# EAGLE design PhotonSMTTest1 (EAGLE 7.3.0)
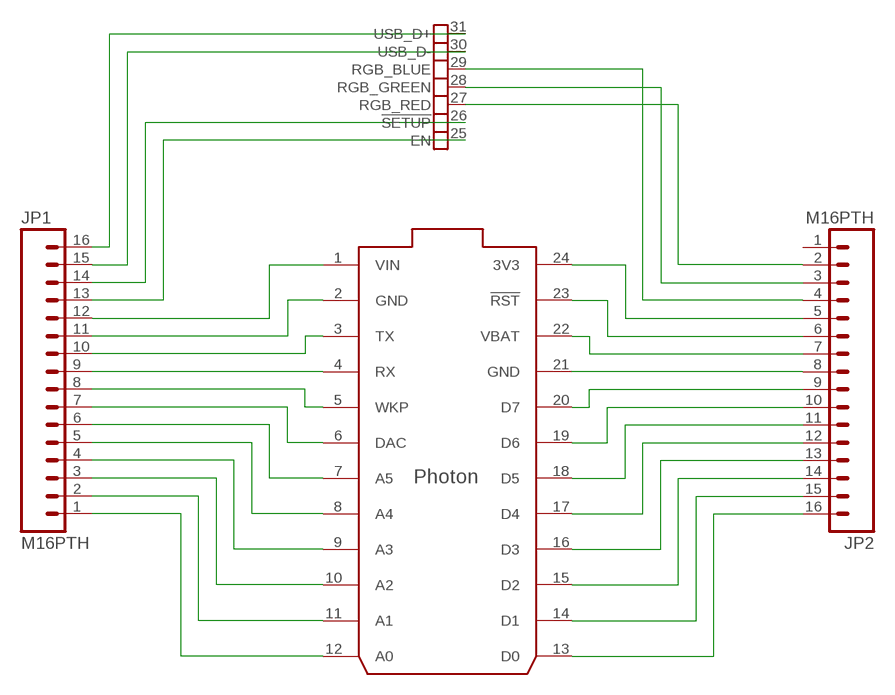
[diagram p0: schematic, sheet 1]

## Parts
.  PHOTON_SMD  [PHOTON_SMD]
JP1  M16PTH  [1X16]
JP2  M16PTH  [1X16]

## Nets
GND: ..2(GND) ..21(GND) JP1.11 JP2.8
N$1: ..1(VIN) JP1.12
N$2: ..31(USB_D+) JP1.16
N$3: ..3(TX) JP1.10
N$4: ..4(RX) JP1.9
N$5: ..6(DAC) JP1.7
N$6: ..8(A4) JP1.5
N$7: ..7(A5) JP1.6
N$8: ..5(WKP) JP1.8
N$9: ..9(A3) JP1.4
N$10: ..10(A2) JP1.3
N$11: ..11(A1) JP1.2
N$12: ..12(A0) JP1.1
N$13: ..24(3V3) JP2.5
N$14: ..23(!RST) JP2.6
N$15: ..22(VBAT) JP2.7
N$16: ..30(USB_D-) JP1.15
N$17: ..20(D7) JP2.9
N$18: ..19(D6) JP2.10
N$19: ..18(D5) JP2.11
N$20: ..17(D4) JP2.12
N$21: ..16(D3) JP2.13
N$22: ..15(D2) JP2.14
N$23: ..14(D1) JP2.15
N$24: ..13(D0) JP2.16
N$25: ..29(RGB_BLUE) JP2.4
N$26: ..28(RGB_GREEN) JP2.3
N$27: ..27(RGB_RED) JP2.2
N$30: ..26(!SETUP) JP1.14
N$31: ..25(EN) JP1.13
Unconnected: JP2.1

## Library data of the parts
. = Particle-Devices:PHOTON_SMD: Particle Photon (without headers) WiFi development board footprint - designed to be surface mounted with 7 extra exposed pads on the bottom of the board which include, 3 RGB LED outputs, /SETUP, EN (3.3V SMPS enable input), USB D+ and USB D-.
JP1 JP2 = rickk2:M16: 1x16 .1" header

## Board
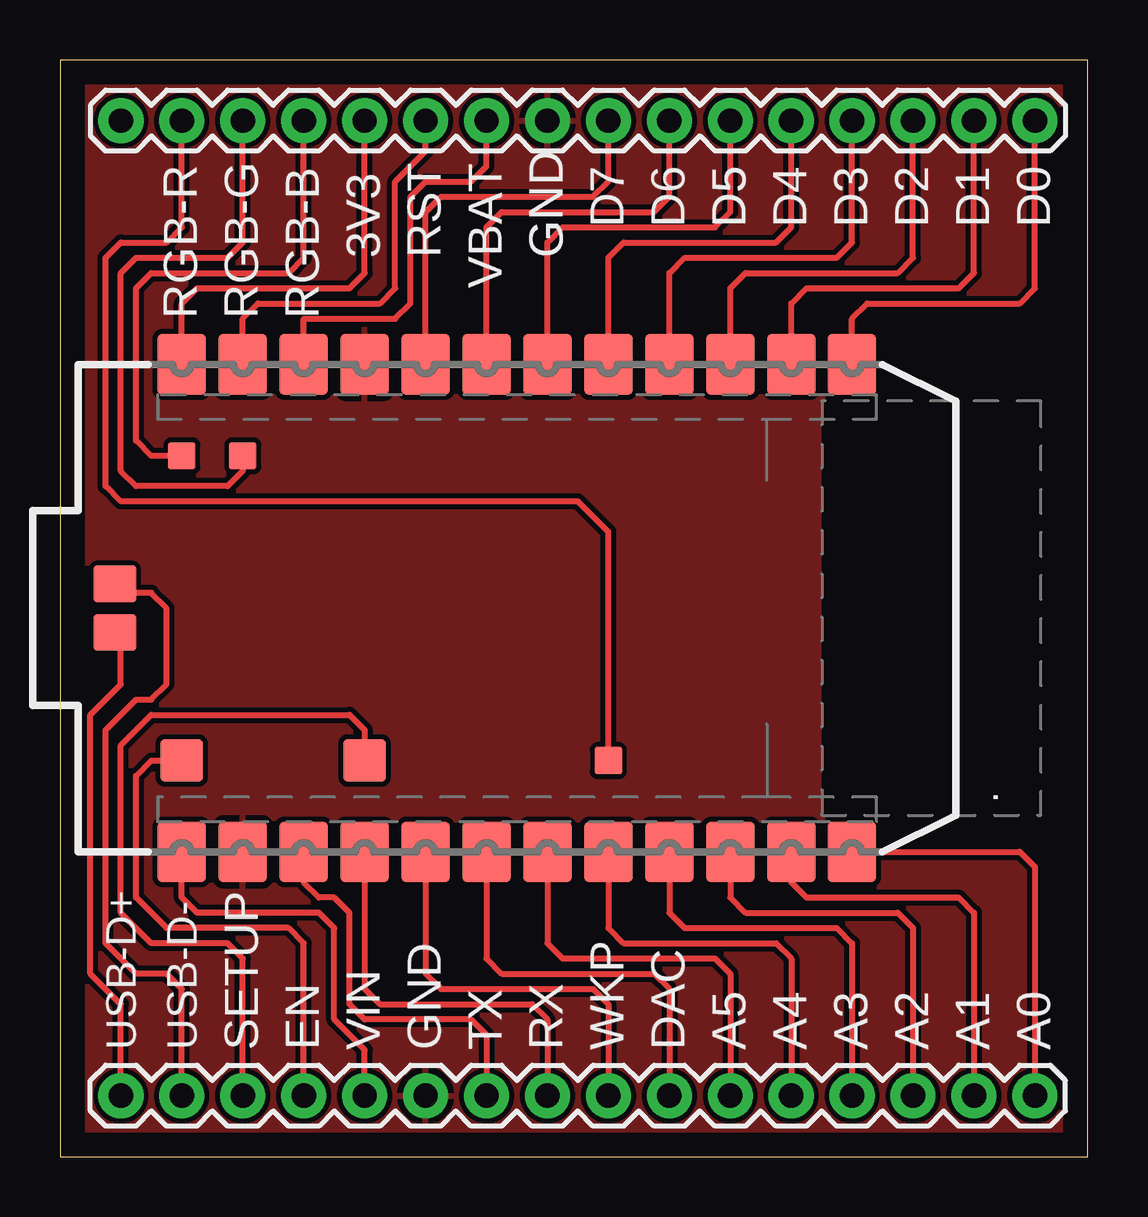
[diagram p1: board, top side]
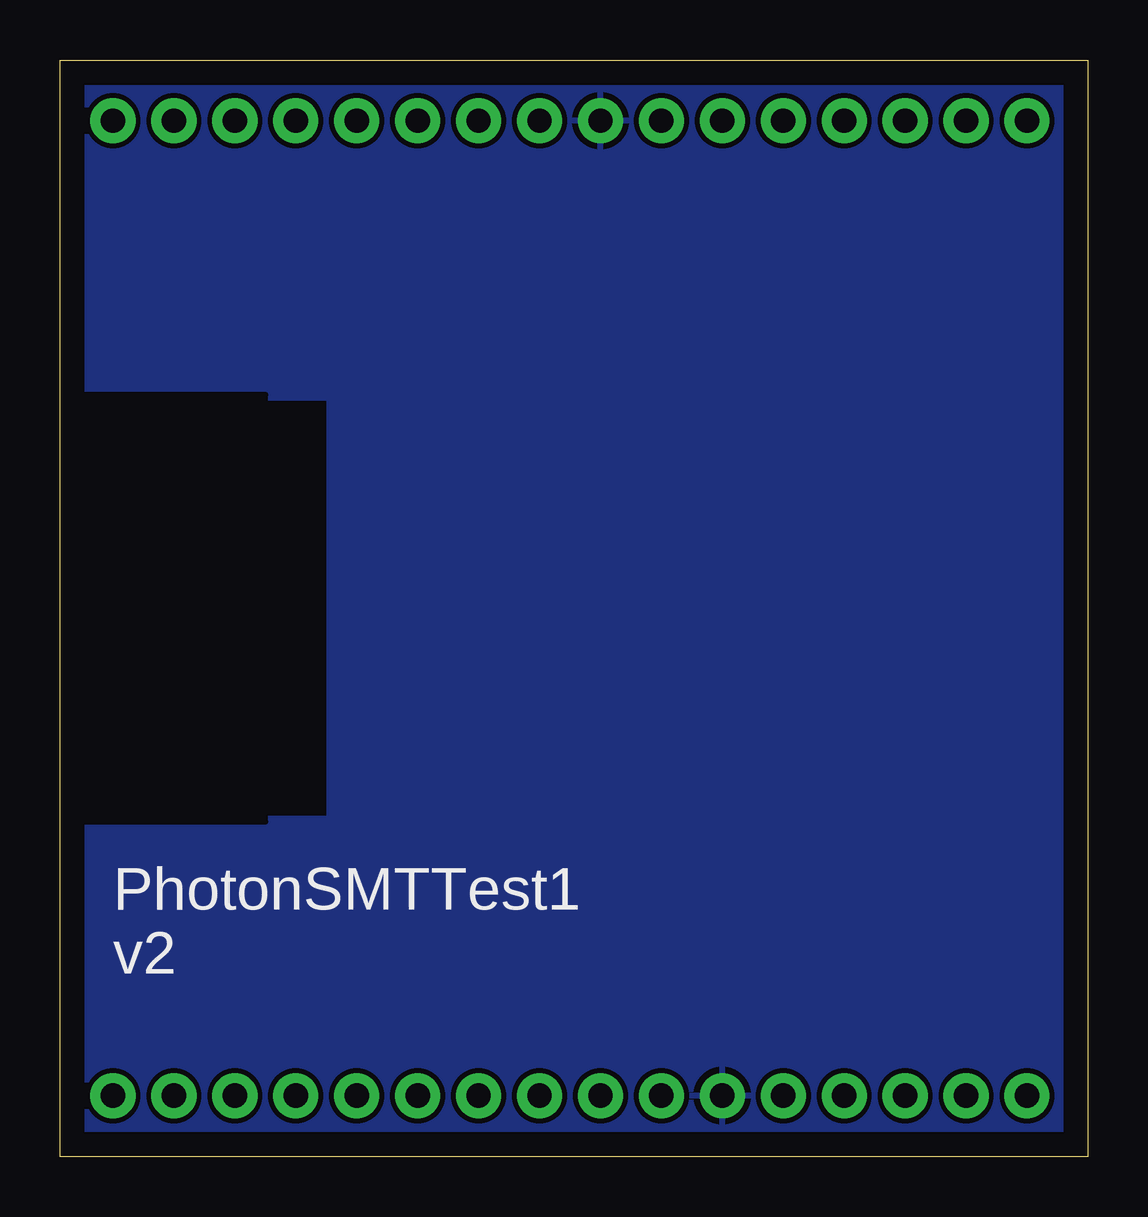
[diagram p2: board, bottom side, seen from below]

Size 42.85 x 45.71 mm. Coordinates in mm from the lower left corner, seen from the top.
Outline: 0,0 42.85,0 42.85,45.71 0,45.71 0,0
Copper layers (1*16): Top 0.035mm / dielectric 1.5mm / Bottom 0.035mm
Design rules "default": minimum track width 10mil, minimum drill 24mil, track to track 8mil, track to pad 8mil, pad to pad 8mil, via to via 8mil, smd to smd 8mil, copper to edge 40mil, drill to drill 8mil, minimum pad ring 10mil, minimum via ring 8mil, stop-mask expansion 4mil, vias tented up to drill 0mil, thermal gap 10mil
bRestrict: area 34.3,14 to 41.9,31.8

### Footprints (pad centres in the part's own frame; a part is rotated, then mirrored left to right if it is on the bottom)
PHOTON_SMD = smd 2.54 x 2.032: 1 0,33.02; 2 0,30.48; 3 0,27.94; 4 0,25.4; 5 0,22.86; 6 0,20.32; 7 0,17.78; 8 0,15.24; 9 0,12.7; 10 0,10.16; 11 0,7.62; 12 0,5.08; 13 20.32,5.08; 14 20.32,7.62; 15 20.32,10.16; 16 20.32,12.7; 17 20.32,15.24; 18 20.32,17.78; 19 20.32,20.32; 20 20.32,22.86; 21 20.32,25.4; 22 20.32,27.94; 23 20.32,30.48; 24 20.32,33.02 | smd 1.778 x 1.778: 25 3.81,33.02; 26 3.81,25.4 | smd 1.143 x 1.143: 27 3.81,15.24; 28 16.51,30.48; 29 16.51,33.02 | smd 1.524 x 1.778: 30 11.176,35.814; 31 9.144,35.814
1X16 = drill 1.016 pad 1.88: 1 0,0; 2 2.54,0; 3 5.08,0; 4 7.62,0; 5 10.16,0; 6 12.7,0; 7 15.24,0; 8 17.78,0; 9 20.32,0; 10 22.86,0; 11 25.4,0; 12 27.94,0; 13 30.48,0; 14 33.02,0; 15 35.56,0; 16 38.1,0

### Placement (x,y rotation side)
.  38.1,12.7 90 top
JP1  40.64,2.54 180 top
JP2  2.54,43.18 0 top

### Tracks (layer width: path | path; a pad name or v marks a point on that pad's centre or on a via)
GND
  pour Top: 0,45.72 43.18,45.72 43.18,0 0,0
  pour Bottom: 0,45.72 43.18,45.72 43.18,0 0,0
N$1
  Top 0.254: JP1.12 12.7,4.45 11.43,5.71 11.43,9.53 10.79,10.16 5.71,10.16 5.08,10.79 ..1
N$2
  Top 0.254: JP1.16 2.54,6.35 1.27,7.62 1.27,18.41 2.54,19.68 2.54,21.59 ..31
N$3
  Top 0.254: JP1.10 17.78,5.08 17.14,5.71 12.7,5.71 12.06,6.35 12.06,10.16 11.43,10.79 10.79,10.79 10.16,11.43 ..3
N$4
  Top 0.254: ..4 12.7,6.99 13.34,6.35 19.68,6.35 20.32,5.71 JP1.9
N$5
  Top 0.254: ..6 17.78,8.26 18.41,7.62 24.77,7.62 25.4,6.99 JP1.7
N$6
  Top 0.254: ..8 22.86,9.53 23.5,8.89 29.84,8.89 30.48,8.26 JP1.5
N$7
  Top 0.254: ..7 20.32,8.89 20.95,8.26 27.3,8.26 27.94,7.62 JP1.6
N$8
  Top 0.254: ..5 15.24,7.62 15.88,6.99 22.23,6.99 22.86,6.35 JP1.8
N$9
  Top 0.254: ..9 25.4,10.16 26.04,9.53 32.38,9.53 33.02,8.89 JP1.4
N$10
  Top 0.254: ..10 27.94,10.79 28.57,10.16 34.92,10.16 35.56,9.53 JP1.3
N$11
  Top 0.254: ..11 30.48,11.43 31.11,10.79 37.47,10.79 38.1,10.16 JP1.2
N$12
  Top 0.254: ..12 40.01,12.7 40.64,12.06 JP1.1
N$13
  Top 0.254: ..24 5.08,35.56 5.71,36.2 12.06,36.2 12.7,36.83 JP2.5
N$14
  Top 0.254: ..23 7.62,34.92 8.26,35.56 13.34,35.56 13.97,36.2 13.97,40.64 15.24,41.91 JP2.6
N$15
  Top 0.254: ..22 10.16,34.92 13.97,34.92 14.61,35.56 14.61,40.01 15.24,40.64 17.14,40.64 17.78,41.27 JP2.7
N$16
  Top 0.254: JP1.15 5.08,6.99 4.45,7.62 3.17,7.62 1.91,8.89 1.91,17.78 3.17,19.05 3.81,19.05 4.45,19.68 4.45,22.86 3.81,23.5 2.67,23.5 ..30
N$17
  Top 0.254: ..20 15.24,39.37 15.88,40.01 22.23,40.01 22.86,40.64 JP2.9
N$18
  Top 0.254: ..19 17.78,38.73 18.41,39.37 24.77,39.37 25.4,40.01 JP2.10
N$19
  Top 0.254: ..18 20.32,38.1 20.95,38.73 27.3,38.73 27.94,39.37 JP2.11
N$20
  Top 0.254: ..17 22.86,37.47 23.5,38.1 29.84,38.1 30.48,38.73 JP2.12
N$21
  Top 0.254: ..16 25.4,36.83 26.04,37.47 32.38,37.47 33.02,38.1 JP2.13
N$22
  Top 0.254: ..15 27.94,36.2 28.57,36.83 34.92,36.83 35.56,37.47 JP2.14
N$23
  Top 0.254: ..14 30.48,35.56 31.11,36.2 37.47,36.2 38.1,36.83 JP2.15
N$24
  Top 0.254: ..13 33.02,34.92 33.66,35.56 40.01,35.56 40.64,36.2 JP2.16
N$25
  Top 0.254: JP2.4 10.16,37.47 9.53,36.83 3.81,36.83 3.17,36.2 3.17,29.84 3.81,29.21 ..29
N$26
  Top 0.254: ..28 7.62,28.57 6.99,27.94 3.17,27.94 2.54,28.57 2.54,36.83 3.17,37.47 6.99,37.47 7.62,38.1 JP2.3
N$27
  Top 0.254: ..27 22.86,26.04 21.59,27.3 2.54,27.3 1.91,27.94 1.91,37.47 2.54,38.1 4.45,38.1 5.08,38.73 JP2.2
N$30
  Top 0.254: JP1.14 7.62,8.26 6.99,8.89 3.81,8.89 2.54,10.16 2.54,17.14 3.81,18.41 12.06,18.41 12.7,17.78 ..26
N$31
  Top 0.254: JP1.13 10.16,8.89 9.53,9.53 4.45,9.53 3.17,10.79 3.17,15.88 3.81,16.51 ..25

### Text on the board
tPlace: D7 | D6 | D5 | D5 | D4 | D3 | D2 | D1 | D0 | 3V3 | RST | GND | GND | VBAT | RGB-R | RGB-G | RGB-B | USB-D+ | USB-D- | SETUP | EN | VIN | GND | TX | RX | WKP | DAC | A5 | A4 | A3 | A2 | A1 | A0
bPlace: PhotonSMTTest1 / v2